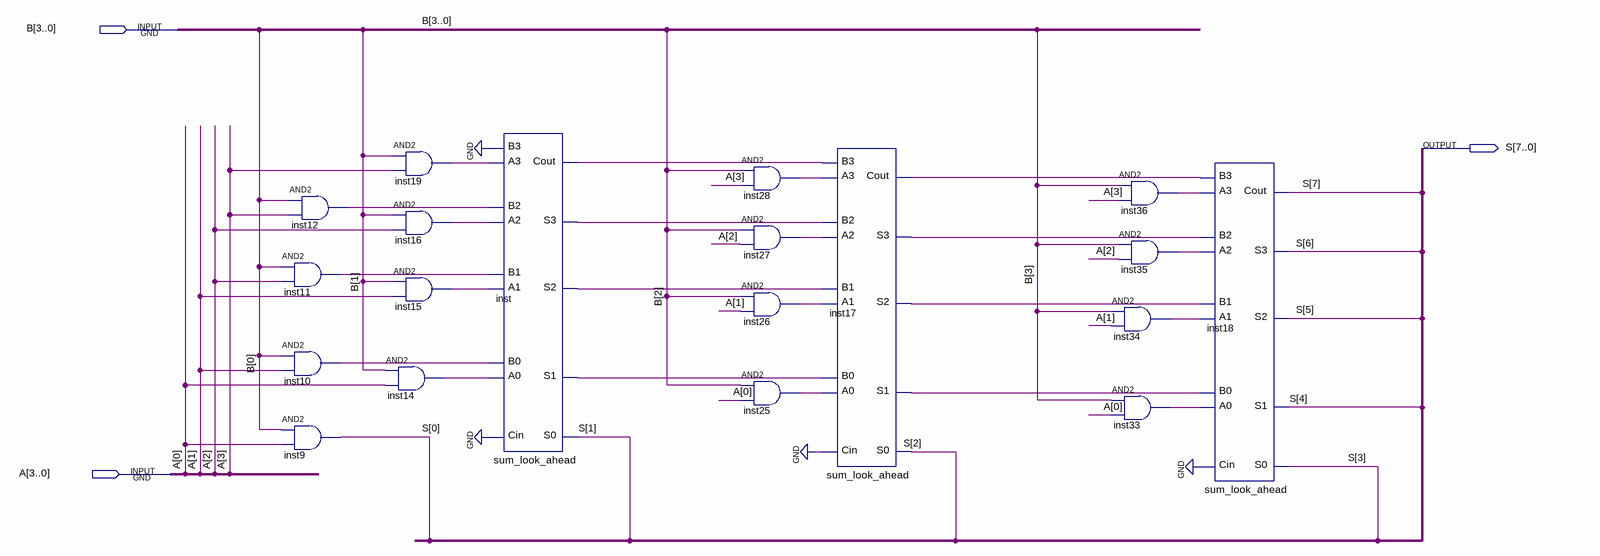
[diagram p0: schematic sheet]
// Quartus schematic MULTIPLIER_4BITS.bdf as structural Verilog: 19 symbols, 3 pins
module MULTIPLIER_4BITS (
  input  [3:0] B,
  input  [3:0] A,
  output [7:0] S
);

  wire inst10_out, inst11_out, inst12_out, inst14_out, inst15_out, inst16_out, inst17_cout, inst17_s1,
       inst17_s2, inst17_s3, inst19_out, inst25_out, inst26_out, inst27_out, inst28_out, inst33_out,
       inst34_out, inst35_out, inst36_out, inst_cout, inst_s1, inst_s2, inst_s3;

  and inst11 (inst11_out, B[0], A[2]);
  and inst10 (inst10_out, B[0], A[1]);
  and inst9 (S[0], B[0], A[0]);
  and inst12 (inst12_out, B[0], A[3]);
  and inst19 (inst19_out, B[1], A[3]);
  and inst16 (inst16_out, B[1], A[2]);
  and inst15 (inst15_out, B[1], A[1]);
  and inst14 (inst14_out, B[1], A[0]);
  sum_look_ahead inst (
    .Cin(1'b0), .A0(inst14_out), .B0(inst10_out), .A1(inst15_out), .B1(inst11_out), .A2(inst16_out),
    .B2(inst12_out), .A3(inst19_out), .B3(1'b0), .S0(S[1]), .S1(inst_s1), .S2(inst_s2), .S3(inst_s3),
    .Cout(inst_cout));
  and inst28 (inst28_out, B[2], A[3]);
  and inst27 (inst27_out, B[2], A[2]);
  and inst26 (inst26_out, B[2], A[1]);
  and inst25 (inst25_out, B[2], A[0]);
  sum_look_ahead inst17 (
    .Cin(1'b0), .A0(inst25_out), .B0(inst_s1), .A1(inst26_out), .B1(inst_s2), .A2(inst27_out), .B2(inst_s3),
    .A3(inst28_out), .B3(inst_cout), .S0(S[2]), .S1(inst17_s1), .S2(inst17_s2), .S3(inst17_s3),
    .Cout(inst17_cout));
  and inst34 (inst34_out, B[3], A[1]);
  and inst33 (inst33_out, B[3], A[0]);
  and inst36 (inst36_out, B[3], A[3]);
  and inst35 (inst35_out, B[3], A[2]);
  sum_look_ahead inst18 (
    .Cin(1'b0), .A0(inst33_out), .B0(inst17_s1), .A1(inst34_out), .B1(inst17_s2), .A2(inst35_out),
    .B2(inst17_s3), .A3(inst36_out), .B3(inst17_cout), .S0(S[3]), .S1(S[4]), .S2(S[5]), .S3(S[6]), .Cout(S[7]));
endmodule
